# Altium schematic sheet Sheet1.SchDoc
size A4
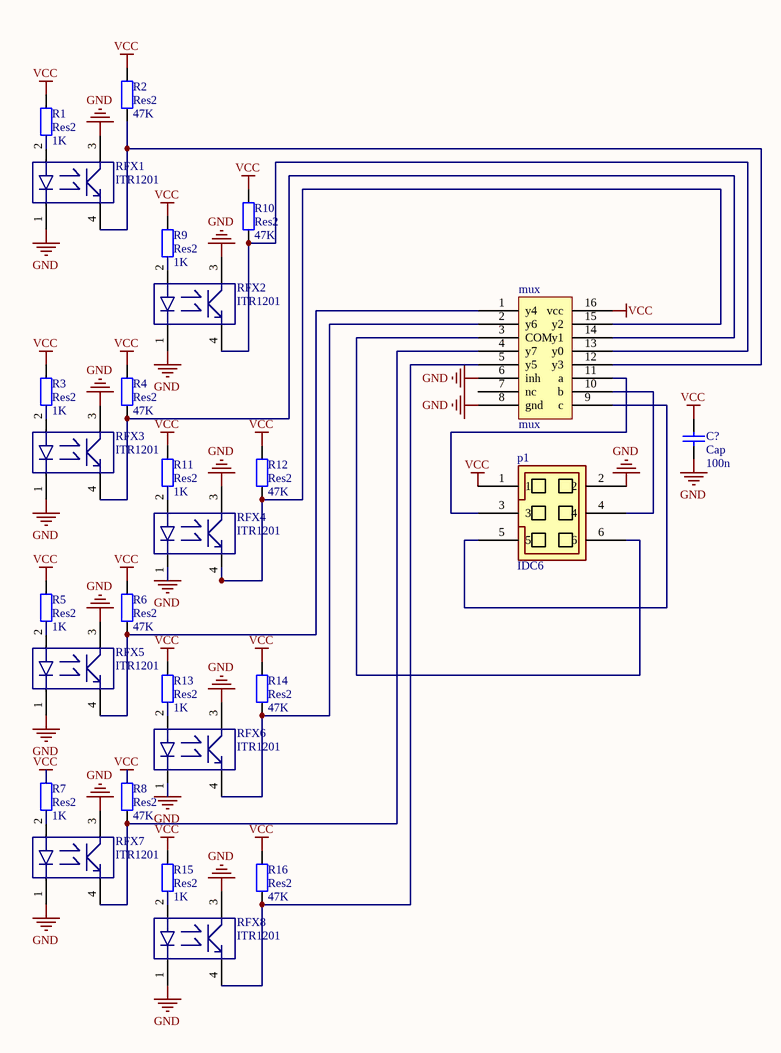
[diagram p0: Sheet1.SchDoc]

## Parts
C?  Cap  value 100n  [6-0805_N]
mux  mux  [SO-16_N]
p1  IDC6  [IDC6]
R1  Res2  value 1K  [6-0805_N]
R2  Res2  value 47K  [6-0805_N]
R3  Res2  value 1K  [6-0805_N]
R4  Res2  value 47K  [6-0805_N]
R5  Res2  value 1K  [6-0805_N]
R6  Res2  value 47K  [6-0805_N]
R7  Res2  value 1K  [6-0805_N]
R8  Res2  value 47K  [6-0805_N]
R9  Res2  value 1K  [6-0805_N]
R10  Res2  value 47K  [6-0805_N]
R11  Res2  value 1K  [6-0805_N]
R12  Res2  value 47K  [6-0805_N]
R13  Res2  value 1K  [6-0805_N]
R14  Res2  value 47K  [6-0805_N]
R15  Res2  value 1K  [6-0805_N]
R16  Res2  value 47K  [6-0805_N]
RFX1  ITR1201  [LCC4 - duplicate4]
RFX2  ITR1201  [LCC4 - duplicate4]
RFX3  ITR1201  [LCC4 - duplicate4]
RFX4  ITR1201  [LCC4 - duplicate4]
RFX5  ITR1201  [LCC4 - duplicate4]
RFX6  ITR1201  [LCC4 - duplicate4]
RFX7  ITR1201  [LCC4 - duplicate4]
RFX8  ITR1201  [LCC4 - duplicate4]

## Nets
GND: C?.1 mux.6(inh) mux.8(gnd) p1.2 RFX1.1 RFX1.3 RFX2.1 RFX2.3 RFX3.1 RFX3.3 RFX4.1 RFX4.3 RFX5.1 RFX5.3 RFX6.1 RFX6.3 RFX7.1 RFX7.3 RFX8.1 RFX8.3
VCC: C?.2 mux.16(vcc) p1.1 R1.2 R2.2 R3.2 R4.2 R5.2 R6.2 R7.2 R8.2 R9.2 R10.2 R11.2 R12.2 R13.2 R14.2 R15.2 R16.2
Netmux_1: mux.1(y4) R6.1 RFX5.4
Netmux_2: mux.2(y6) R14.1 RFX6.4
Netmux_3: mux.3(COM) p1.6
Netmux_4: mux.4(y7) R8.1 RFX7.4
Netmux_5: mux.5(y5) R16.1 RFX8.4
Netmux_9: mux.9(c) p1.5
Netmux_10: mux.10(b) p1.4
Netmux_11: mux.11(a) p1.3
Netmux_12: mux.12(y3) R2.1 RFX1.4
Netmux_13: mux.13(y0) R10.1 RFX2.4
Netmux_14: mux.14(y1) R4.1 RFX3.4
Netmux_15: mux.15(y2) R12.1 RFX4.4
NetR1_1: R1.1 RFX1.2
NetR3_1: R3.1 RFX3.2
NetR5_1: R5.1 RFX5.2
NetR7_1: R7.1 RFX7.2
NetR9_1: R9.1 RFX2.2
NetR11_1: R11.1 RFX4.2
NetR13_1: R13.1 RFX6.2
NetR15_1: R15.1 RFX8.2

Not connected (* = marked no-connect by the designer): mux 7(nc)

## Library data of the parts
C? = Cap: Capacitor; Published: 8-Jun-2000; LatestRevisionDate: 17-Jul-2002; LatestRevisionNote: Re-released for DXP Platform.; PackageReference: RAD-0.3; Publisher: Altium Limited; PackageDescription: Radial Cap, Thru-Hole; 2 Leads; 0.3 in Pin Spacing
p1 = IDC6: 6pin IDC connector
R1-R16 = Res2: Resistor; Published: 8-Jun-2000; LatestRevisionDate: 17-Jul-2002; LatestRevisionNote: Re-released for DXP Platform.; PackageReference: AXIAL-0.4; Publisher: Altium Limited; PackageDescription: Axial Device, Thru-Hole; 2 Leads; 0.4 in Pin Spacing
RFX1-RFX8 = ITR1201: Name: ITR1201